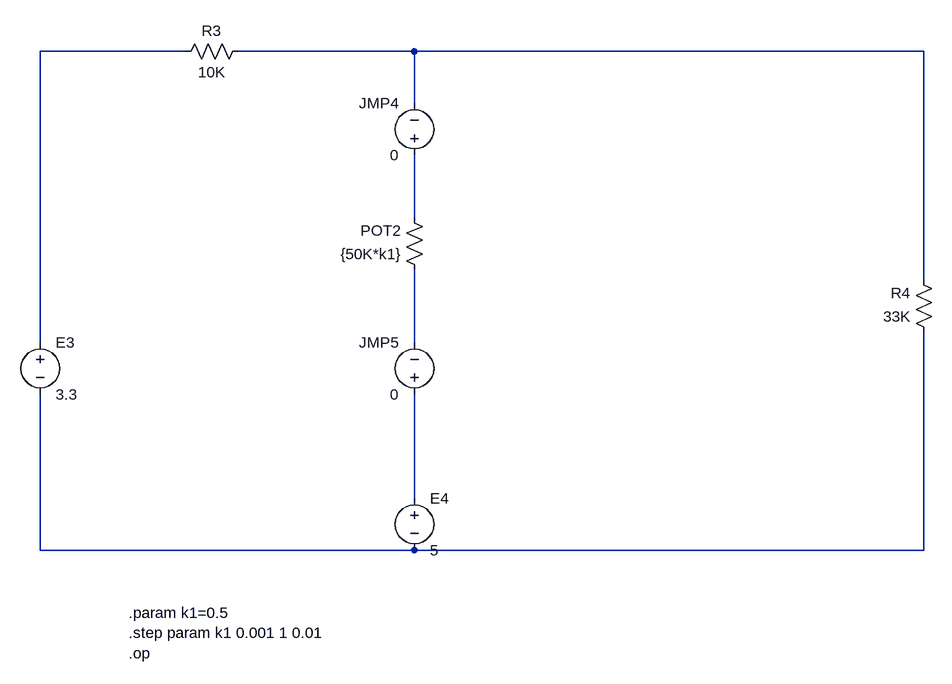
[diagram p0: schematic lab32.asc]
lab32.asc, the LTspice schematic file:
Version 4.1
SHEET 1 1348 680
WIRE 192 -304 -32 -304
WIRE 544 -304 272 -304
WIRE 1328 -304 544 -304
WIRE 544 -224 544 -304
WIRE 544 -48 544 -144
WIRE 1328 48 1328 -304
WIRE -32 144 -32 -304
WIRE 544 144 544 32
WIRE 544 384 544 224
WIRE -32 464 -32 224
WIRE 544 464 -32 464
WIRE 1328 464 1328 128
WIRE 1328 464 544 464
SYMBOL voltage -32 128 R0
WINDOW 123 0 0 Left 0
WINDOW 39 0 0 Left 0
SYMATTR InstName E3
SYMATTR Value 3.3
SYMBOL voltage 544 368 R0
WINDOW 123 0 0 Left 0
WINDOW 39 0 0 Left 0
SYMATTR InstName E4
SYMATTR Value 5
SYMBOL res 288 -320 R90
WINDOW 0 0 56 VBottom 2
WINDOW 3 32 56 VTop 2
SYMATTR InstName R3
SYMATTR Value 10K
SYMBOL res 560 48 R180
WINDOW 0 36 76 Left 2
WINDOW 3 36 40 Left 2
SYMATTR InstName POT2
SYMATTR Value {50K*k1}
SYMBOL res 1344 144 R180
WINDOW 0 36 76 Left 2
WINDOW 3 36 40 Left 2
SYMATTR InstName R4
SYMATTR Value 33K
SYMBOL voltage 544 -128 R180
WINDOW 0 24 96 Left 2
WINDOW 3 24 16 Left 2
WINDOW 123 0 0 Left 0
WINDOW 39 0 0 Left 0
SYMATTR InstName JMP4
SYMATTR Value 0
SYMBOL voltage 544 240 R180
WINDOW 0 24 96 Left 2
WINDOW 3 24 16 Left 2
WINDOW 123 0 0 Left 0
WINDOW 39 0 0 Left 0
SYMATTR InstName JMP5
SYMATTR Value 0
TEXT 104 560 Left 2 !.param k1=0.5\n.step param k1 0.001 1 0.01\n.op

The netlist it stands for:
* lab32.asc
V§E3 N001 N006 3.3
V§E4 N005 N006 5
R3 N002 N001 10K
R§POT2 N004 N003 {50K*k1}
R4 N006 N002 33K
V§JMP4 N003 N002 0
V§JMP5 N005 N004 0
.param k1=0.5
.step param k1 0.001 1 0.01
.op
.backanno
.end